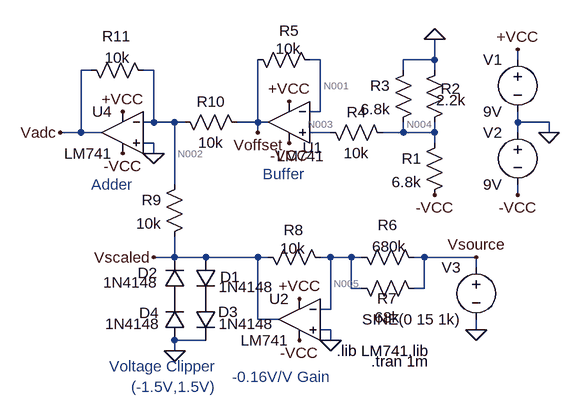
[diagram p0: schematic analog_preprocessing.asc]
analog_preprocessing.asc, the LTspice schematic file:
Version 4
SHEET 1 912 788
WIRE 256 208 240 208
WIRE 432 208 432 176
WIRE 432 208 384 208
WIRE 560 208 560 192
WIRE -96 224 -112 224
WIRE 0 224 -16 224
WIRE 384 224 384 208
WIRE 432 224 432 208
WIRE 256 288 256 208
WIRE 256 288 240 288
WIRE 0 304 0 224
WIRE 0 304 -16 304
WIRE 32 304 0 304
WIRE 48 304 32 304
WIRE 160 304 160 208
WIRE 160 304 128 304
WIRE 176 304 160 304
WIRE 560 304 560 288
WIRE 608 304 560 304
WIRE -112 320 -112 224
WIRE -112 320 -144 320
WIRE -80 320 -112 320
WIRE 160 320 160 304
WIRE 272 320 240 320
WIRE 384 320 384 304
WIRE 384 320 352 320
WIRE 432 320 432 304
WIRE 432 320 384 320
WIRE 560 320 560 304
WIRE 608 320 608 304
WIRE 0 336 -16 336
WIRE 432 336 432 320
WIRE 0 352 0 336
WIRE 32 400 32 304
WIRE 560 416 560 400
WIRE 32 512 32 480
WIRE 32 512 0 512
WIRE 80 512 32 512
WIRE 160 512 80 512
WIRE 176 512 160 512
WIRE 272 512 256 512
WIRE 304 512 272 512
WIRE 320 512 304 512
WIRE 416 512 400 512
WIRE 496 512 416 512
WIRE 496 528 496 512
WIRE 304 560 304 512
WIRE 320 560 304 560
WIRE 416 560 416 512
WIRE 416 560 400 560
WIRE 272 592 272 512
WIRE 272 592 256 592
WIRE 160 608 160 512
WIRE 192 608 160 608
WIRE 272 624 256 624
WIRE 496 624 496 608
WIRE 80 640 32 640
WIRE 272 640 272 624
WIRE 32 656 32 640
FLAG 608 320 0
FLAG 560 192 +VCC
FLAG 560 416 -VCC
FLAG 432 176 0
FLAG 208 272 +VCC
FLAG 208 336 -VCC
FLAG 496 624 0
FLAG 224 576 +VCC
FLAG 224 640 -VCC
FLAG 496 512 Vsource
FLAG 272 640 0
FLAG -48 288 +VCC
FLAG -48 352 -VCC
FLAG -144 320 Vadc
FLAG 0 352 0
FLAG 160 320 Voffset
FLAG 432 416 -VCC
FLAG 32 656 0
FLAG 0 512 Vscaled
SYMBOL voltage 560 192 M0
WINDOW 123 0 0 Left 0
WINDOW 39 0 0 Left 0
SYMATTR InstName V1
SYMATTR Value 9V
SYMBOL voltage 560 304 M0
WINDOW 123 0 0 Left 0
WINDOW 39 0 0 Left 0
SYMATTR InstName V2
SYMATTR Value 9V
SYMBOL res 448 320 M0
SYMATTR InstName R1
SYMATTR Value 6.8k
SYMBOL res 448 208 M0
WINDOW 0 -24 44 Left 2
WINDOW 3 -32 62 Left 2
SYMATTR InstName R2
SYMATTR Value 2.2k
SYMBOL res 400 208 M0
SYMATTR InstName R3
SYMATTR Value 6.8k
SYMBOL OpAmps\\opamp2 208 240 M0
WINDOW 0 -52 103 Left 2
WINDOW 3 -55 116 Left 2
SYMATTR InstName U1
SYMATTR Value LM741
SYMBOL res 144 192 M90
WINDOW 0 -13 64 VBottom 2
WINDOW 3 -17 63 VTop 2
SYMATTR InstName R5
SYMATTR Value 10k
SYMBOL res 256 304 M90
WINDOW 0 0 56 VBottom 2
WINDOW 3 32 56 VTop 2
SYMATTR InstName R4
SYMATTR Value 10k
SYMBOL voltage 496 512 M0
WINDOW 123 0 0 Left 0
WINDOW 39 0 0 Left 0
SYMATTR InstName V3
SYMATTR Value SINE(0 15 1k)
SYMBOL OpAmps\\opamp2 224 544 M0
SYMATTR InstName U2
SYMATTR Value LM741
SYMBOL res 304 496 M90
WINDOW 0 -18 56 VBottom 2
WINDOW 3 -16 58 VTop 2
SYMATTR InstName R6
SYMATTR Value 680k
SYMBOL res 304 544 M90
WINDOW 0 47 55 VBottom 2
WINDOW 3 45 55 VTop 2
SYMATTR InstName R7
SYMATTR Value 68k
SYMBOL res 160 496 M90
WINDOW 0 -10 55 VBottom 2
WINDOW 3 -13 54 VTop 2
SYMATTR InstName R8
SYMATTR Value 10k
SYMBOL OpAmps\\opamp2 -48 256 M0
SYMATTR InstName U4
SYMATTR Value LM741
SYMBOL res 144 320 M270
WINDOW 0 32 56 VTop 2
WINDOW 3 0 56 VBottom 2
SYMATTR InstName R10
SYMATTR Value 10k
SYMBOL res 0 240 M270
WINDOW 0 53 57 VTop 2
WINDOW 3 51 56 VBottom 2
SYMATTR InstName R11
SYMATTR Value 10k
SYMBOL diode 64 512 R0
WINDOW 0 38 30 Left 2
WINDOW 3 36 46 Left 2
SYMATTR InstName D1
SYMATTR Value 1N4148
SYMBOL diode 48 576 R180
WINDOW 0 42 40 Left 2
WINDOW 3 41 25 Left 2
SYMATTR InstName D2
SYMATTR Value 1N4148
SYMBOL diode 64 576 R0
WINDOW 0 35 20 Left 2
WINDOW 3 36 39 Left 2
SYMATTR InstName D3
SYMATTR Value 1N4148
SYMBOL diode 48 640 R180
WINDOW 0 40 42 Left 2
WINDOW 3 38 25 Left 2
SYMATTR InstName D4
SYMATTR Value 1N4148
SYMBOL res 48 384 M0
SYMATTR InstName R9
SYMATTR Value 10k
TEXT 424 672 Right 2 !.tran 1m
TEXT 232 384 Right 2 ;Buffer
TEXT -32 400 Right 2 ;Adder
TEXT 96 680 Right 2 ;Voltage Clipper\n(-1.5V,1.5V)
TEXT 272 696 Right 2 ;-0.16V/V Gain
TEXT 424 656 Right 2 !.lib LM741.lib

The netlist it stands for:
* analog_preprocessing.asc
V1 +VCC 0 9V
V2 0 -VCC 9V
R1 N004 -VCC 6.8k
R2 0 N004 2.2k
R3 0 N004 6.8k
XU1 N003 N001 +VCC -VCC Voffset LM741  ; pins In+ In- V+ V- OUT
R5 Voffset N001 10k
R4 N003 N004 10k
V3 Vsource 0 SINE(0 15 1k)
XU2 0 N005 +VCC -VCC Vscaled LM741  ; pins In+ In- V+ V- OUT
R6 N005 Vsource 680k
R7 N005 Vsource 68k
R8 Vscaled N005 10k
XU4 0 N002 +VCC -VCC Vadc LM741  ; pins In+ In- V+ V- OUT
R10 Voffset N002 10k
R11 N002 Vadc 10k
D1 Vscaled P001 1N4148
D2 P002 Vscaled 1N4148
D3 P001 0 1N4148
D4 0 P002 1N4148
R9 N002 Vscaled 10k
.model D D
.lib standard.dio
.tran 1m
* Buffer
* Adder
* Voltage Clipper
* (-1.5V,1.5V)
* -0.16V/V Gain
.lib LM741.lib
.backanno
.end

* Results of the author's LTspice run, read from the files saved beside the schematic
* Operating Point, zero values left out:
*   V(+vcc) = 9 V
*   V(-vcc) = -9 V
*   V(n004) = -1.768 V
*   V(n001) = -1.768 V
*   V(n003) = -1.769 V
*   V(voffset) = -1.767 V
*   V(n005) = 1 mV
*   V(vscaled) = 2.18 mV
*   V(n002) = 991 µV
*   V(vadc) = 1.768 V
*   V(p001) = 1.09 mV
*   V(p002) = 1.09 mV
*   I(D4) = -64.14 pA
*   I(D3) = 56.55 pA
*   I(D2) = -64.14 pA
*   I(D1) = 56.55 pA
*   I(R9) = -118.9 nA
*   I(R11) = -176.7 µA
*   I(R10) = -176.8 µA
*   I(R8) = 118 nA
*   I(R7) = 14.71 nA
*   I(R6) = 1.471 nA
*   I(R4) = -57.94 nA
*   I(R5) = 101.8 nA
*   I(R3) = 260 µA
*   I(R2) = 803.6 µA
*   I(R1) = 1.064 mA
*   I(V3) = 16.18 nA
*   I(V2) = -5.794 mA
*   I(V1) = -4.731 mA
*   Ix(u1:1) = 57.94 nA
*   Ix(u1:2) = 101.8 nA
*   Ix(u1:99) = 1.501 mA
*   Ix(u1:50) = -1.678 mA
*   Ix(u1:28) = 176.7 µA
*   Ix(u2:1) = 57.86 nA
*   Ix(u2:2) = 101.9 nA
*   Ix(u2:99) = 1.551 mA
*   Ix(u2:50) = -1.551 mA
*   Ix(u2:28) = -237.1 nA
*   Ix(u4:1) = 57.9 nA
*   Ix(u4:2) = 101.8 nA
*   Ix(u4:99) = 1.678 mA
*   Ix(u4:50) = -1.502 mA
*   Ix(u4:28) = -176.7 µA
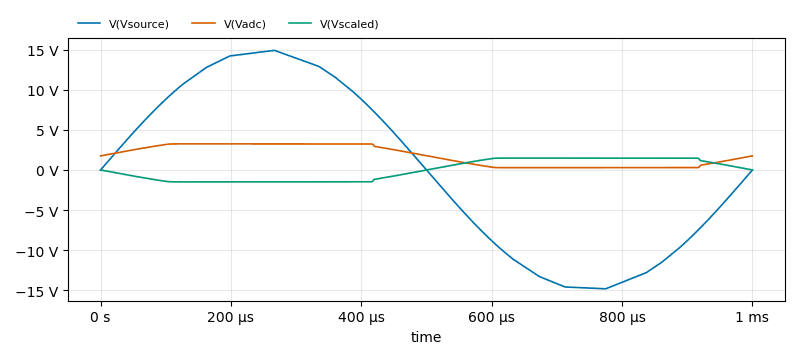
[diagram p1: Transient Analysis of analog_preprocessing.asc, plotted from the saved traces]
* Transient Analysis, 1 run:
*   V(Vsource): min -14.81 V, max 14.91 V, average -5.933 mV, rms 10.53 V, last 0 V
*   V(Vadc): min 285.6 mV, max 3.255 V, average 1.77 V, rms 2.181 V, last 1.758 V
*   V(Vscaled): min -1.485 V, max 1.485 V, average 916.2 µV, rms 1.274 V, last 5.192 mV